# Altium schematic sheet MCU.SchDoc
size A4; SheetNumber: 2; SheetTotal: 4
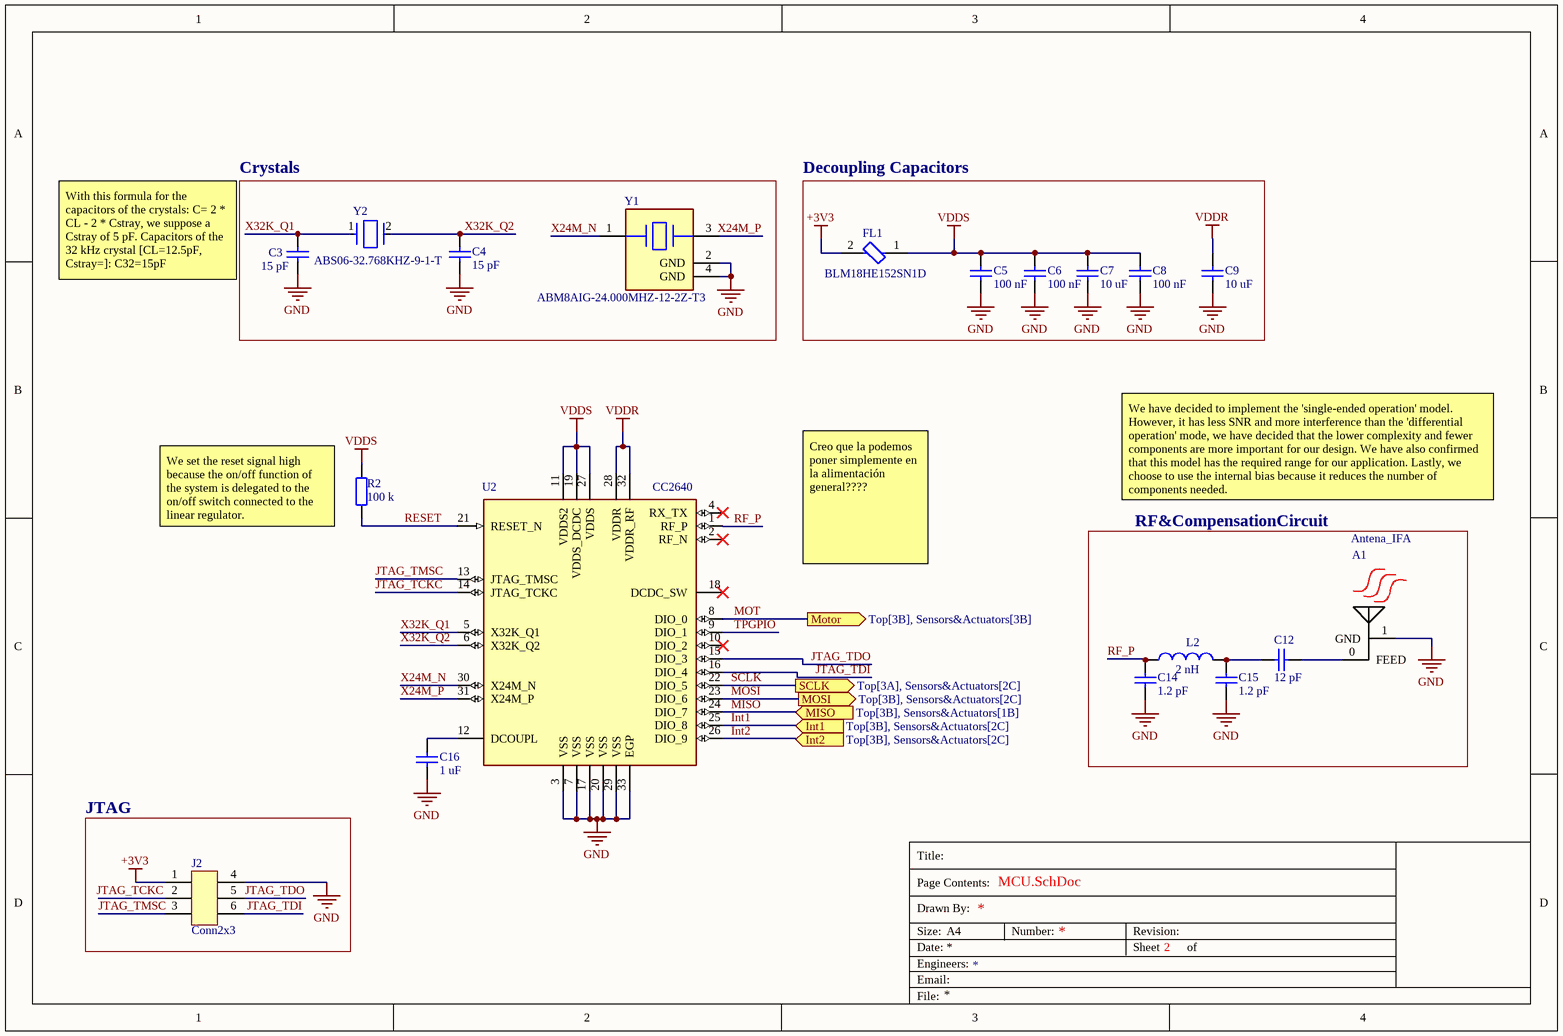
[diagram p0: MCU.SchDoc]

## Parts
A1  Antena_IFA  [ANTENA_IFA]
C3  15 pF  [C0402]
C4  15 pF  [C0402]
C5  100 nF  [C0402]
C6  100 nF  [C0402]
C7  10 uF  [C0402]
C8  100 nF  [C0402]
C9  10 uF  [C0402]
C12  12 pF  [C0402]
C14  1.2 pF  [C0402]
C15  1.2 pF  [C0402]
C16  1 uF  [C0402]
FL1  BLM18HE152SN1D  [FP-BLM18-0_15-t0_8-IPC_C]
J2  Conn2x3  [Pogo_6pins_minimum]
L2  2 nH  [L0402]
R2  100 k  [R0402]
U2  CC2640  [CC2640R2FRSM]
Y1  ABM8AIG-24.000MHZ-12-2Z-T3  [FP-ABM8AIG-MFG]
Y2  ABS06-32.768KHZ-9-1-T  [FP-ABS06-MFG]

## Blocks framed on the sheet
Crystals: C3 C4 Y1 Y2
Decoupling Capacitors: C5-C9 FL1
RF&CompensationCircuit: A1 C12 C14 C15 L2
JTAG: J2

## Ports
Int1 (in, see Top[3B], Sensors&Actuators[2C]), Int2 (in, see Top[3B], Sensors&Actuators[2C]), MISO (in, see Top[3B], Sensors&Actuators[1B]), MOSI (out, see Top[3B], Sensors&Actuators[2C]), Motor (out, see Top[3B], Sensors&Actuators[3B]), SCLK (out, see Top[3A], Sensors&Actuators[2C])

## Nets
+3V3: FL1.2 J2.1
GND: A1.1(GND) C3.1 C4.1 C5.2 C6.2 C7.2 C8.2 C9.2 C14.1 C15.1 C16.1 J2.4 U2.3(VSS) U2.7(VSS) U2.17(VSS) U2.20(VSS) U2.29(VSS) U2.33(EGP) Y1.2(GND) Y1.4(GND)
VDDR: C9.1 U2.28(VDDR) U2.32(VDDR_RF)
VDDS: C5.1 C6.1 C7.1 C8.1 FL1.1 R2.1 U2.11(VDDS2) U2.19(VDDS_DCDC) U2.27(VDDS)
Int1: U2.25(DIO_8) ; port Int1
Int2: U2.26(DIO_9) ; port Int2
JTAG_TCKC: J2.2 U2.14(JTAG_TCKC)
JTAG_TDI: J2.6 U2.16(DIO_4)
JTAG_TDO: J2.5 U2.15(DIO_3)
JTAG_TMSC: J2.3 U2.13(JTAG_TMSC)
MISO: U2.24(DIO_7) ; port MISO
MOSI: U2.23(DIO_6) ; port MOSI
MOT: U2.8(DIO_0) ; port Motor
RESET: R2.2 U2.21(RESET_N)
RF_P: C14.2 L2.1 U2.1(RF_P)
SCLK: U2.22(DIO_5) ; port SCLK
TPGPIO: U2.9(DIO_1)
X24M_N: U2.30(X24M_N) Y1.1
X24M_P: U2.31(X24M_P) Y1.3
X32K_Q1: C3.2 U2.5(X32K_Q1) Y2.1
X32K_Q2: C4.2 U2.6(X32K_Q2) Y2.2
NetA1_0: A1.0(FEED) C12.2
NetC12_1: C12.1 C15.2 L2.2
NetC16_2: C16.2 U2.12(DCOUPL)

Not connected (* = marked no-connect by the designer): U2 2(RF_N)* 4(RX_TX)* 10(DIO_2)* 18(DCDC_SW)*

## Notes on the sheet
- With this formula for the capacitors of the crystals: C= 2 * CL - 2 * Cstray, we suppose a Cstray of 5 pF. Capacitors of the 32 kHz crystal [CL=12.5pF, Cstray=]: C32=15pF
- We have decided to implement the 'single-ended operation' model. However, it has less SNR and more interference than the 'differential operation' mode, we have decided that the lower complexity and fewer components are more important for our design. We have also confirmed that this model has the required range for our application. Lastly, we choose to use the internal bias because it reduces the number of components needed.
- (near R2) We set the reset signal high because the on/off function of the system is delegated to the on/off switch connected to the linear regulator.
- Creo que la podemos poner simplemente en la alimentación general????
- Title:
- Drawn By:
- Page Contents:
- Size:
- Date:
- File:
- Engineers:
- Email:
- A4
- Number:
- Revision:
- Sheet
- of

## Library data of the parts
C3-C9 C12 C14-C16 = C: Capacitor
FL1 = CMP-0686-00368-3: Chip Ferrite Bead, 0603, 1500Ω @ 100MHz, 0.5Ω, 25%, 500mA; Impedance: 1.5kR; DC Resistance (DCR): 500mR; Number of Circuits: 1; Test Frequency: 100MHz; Case/Package: 0603; Max Operating Temperature: 125°C; Package Quantity: 1; Max DC Current: 500mA; Tolerance: 25%; Core Material: Ferrite; Width: 0.8mm; Number of Pins: 2; Depth: 0.8mm; Radiation Hardening: No; Case Code (Imperial): 0603; Min Operating Temperature: -55°C; Termination: SMD/SMT; Material: Ferrite; Military Standard: Not; Number of Lines: 1; DC Current: 500mA; Length: 1.6mm; REACH SVHC: No SVHC; Lead Free: Lead Free; Current Rating: 500mA; Max Current Rating: 500mA; Packaging: Tape and Reel; Case Code (Metric): 1608; Height: 0.8mm
J2 = Conn2x3: 2x3 pin Terminal
L2 = L: Inductor
R2 = R: Resistor
U2 = CC2640: IC RF TXRX+MCU BLUETOOTH 32VFQFN; Manufacturer: Texas Instruments; Part number: CC2640R2FRSM; Supplier 1: Mouser; Supplier Part Number 1: 595-CC2640R2FRSMR
Y1 = CMP-27762-015716-1: Crystal 24MHz ±20ppm (Tol) ±50ppm (Stability) 12pF FUND 50Ω Automotive 4-Pin Ultra Mini-CSMD T/R; ESR (Equivalent Series Resistance): 50R; Series: ABM8AIG; RoHS Compliant: Yes; Load Capacitance: 12pF; Height: 0.031inch; Min Operating Temperature: -40°C; Mount: Surface Mount; Packaging: Cut Tape; Ratings: AEC-Q200; Case/Package: SMD/SMT; Frequency Stability: 50ppm; Max Operating Temperature: 125°C; Length: 0.126inch; Frequency: 24MHz; Frequency Tolerance: 20ppm; Width: 0.098inch
Y2 = CMP-27762-003430-2: Crystal 32.768kHz ±10ppm (Tol) 9pF FUND 90kΩ 2-Pin Mini-CSMD T/R; Series Resistance: 90kR; Series: ABS06; Case/Package: CSMD; Package Quantity: 3000; Load Capacitance: 9pF; Number of Pins: 2; Tolerance: 10ppm; RoHS Compliant: Yes; Depth: 1.2mm; Termination: SMD/SMT; Min Operating Temperature: -40°C; Length: 2mm; Packaging: Tape and Reel; Max Operating Temperature: 85°C; Frequency Tolerance: 10ppm; Width: 1.2mm; ESR (Equivalent Series Resistance): 90kR; Radiation Hardening: No; Frequency: 32.768kHz; REACH SVHC: No SVHC; Mount: Surface Mount; Height: 0.6mm